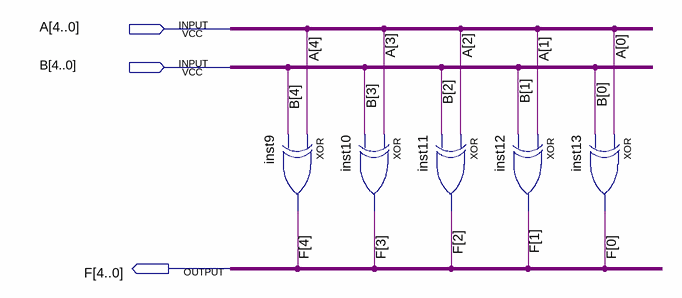
[diagram p0: schematic sheet]
// Quartus schematic XOR5.bdf as structural Verilog: 5 symbols, 3 pins
module XOR5 (
  input  [4:0] A,
  input  [4:0] B,
  output [4:0] F
);

  xor inst9 (F[4], A[4], B[4]);
  xor inst10 (F[3], A[3], B[3]);
  xor inst11 (F[2], A[2], B[2]);
  xor inst12 (F[1], A[1], B[1]);
  xor inst13 (F[0], A[0], B[0]);
endmodule
